# Altium schematic sheet botonera.SchDoc
size A
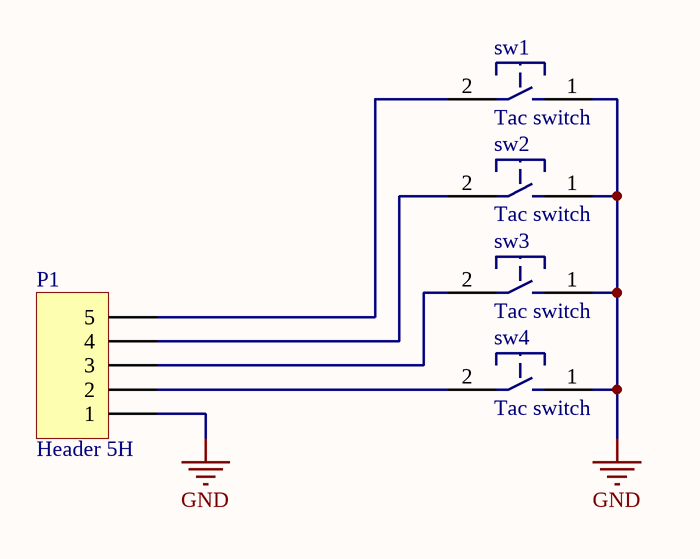
[diagram p0: botonera.SchDoc]

## Parts
P1  Header 5H  [HDR1X5H]
sw1  Tac switch  [MY_TACTILE-PTH]
sw2  Tac switch  [MY_TACTILE-PTH]
sw3  Tac switch  [MY_TACTILE-PTH]
sw4  Tac switch  [MY_TACTILE-PTH]

## Nets
GND: P1.1 sw1.1 sw2.1 sw3.1 sw4.1
NetP1_2: P1.2 sw4.2
NetP1_3: P1.3 sw3.2
NetP1_4: P1.4 sw2.2
NetP1_5: P1.5 sw1.2

## Library data of the parts
P1 = Header 5H: Header, 5-Pin, Right Angle; LatestRevisionDate: 17-Jul-2002; LatestRevisionNote: Re-released for DXP Platform.; Publisher: Altium Limited
sw1-sw4 = Tac switch: small tac switch